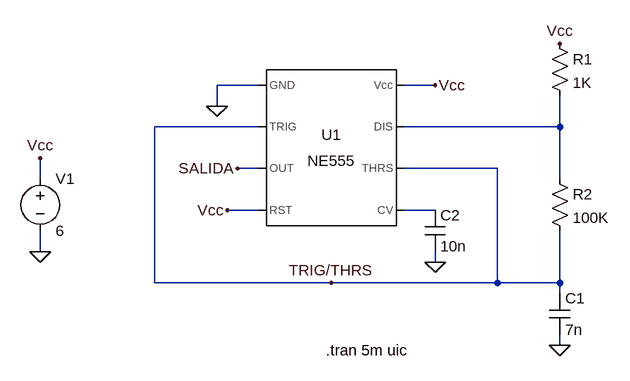
[diagram p0: schematic ne555-astable.asc]
ne555-astable.asc, the LTspice schematic file:
Version 4
SHEET 1 880 680
WIRE 80 80 16 80
WIRE 352 80 304 80
WIRE 16 112 16 80
WIRE 80 144 -80 144
WIRE 544 144 544 96
WIRE 544 144 304 144
WIRE 80 208 48 208
WIRE 448 208 304 208
WIRE -256 224 -256 192
WIRE 544 224 544 144
WIRE 80 272 32 272
WIRE 352 272 304 272
WIRE -256 336 -256 304
WIRE 352 352 352 336
WIRE -80 384 -80 144
WIRE 192 384 -80 384
WIRE 448 384 448 208
WIRE 448 384 192 384
WIRE 544 384 544 304
WIRE 544 384 448 384
WIRE 544 400 544 384
WIRE 544 480 544 464
FLAG -256 336 0
FLAG 352 352 0
FLAG -256 192 Vcc
FLAG 352 80 Vcc
FLAG 32 272 Vcc
FLAG 48 208 SALIDA
FLAG 16 112 0
FLAG 544 16 Vcc
FLAG 544 480 0
FLAG 192 384 TRIG/THRS
SYMBOL Misc\\NE555 192 176 R0
SYMATTR InstName U1
SYMBOL voltage -256 208 R0
WINDOW 123 0 0 Left 0
WINDOW 39 0 0 Left 0
SYMATTR InstName V1
SYMATTR Value 6
SYMBOL res 528 0 R0
SYMATTR InstName R1
SYMATTR Value 1K
SYMBOL res 528 208 R0
SYMATTR InstName R2
SYMATTR Value 100K
SYMBOL cap 336 272 R0
SYMATTR InstName C2
SYMATTR Value 10n
SYMBOL cap 528 400 R0
SYMATTR InstName C1
SYMATTR Value 7n
TEXT 184 488 Left 2 !.tran 5m uic

The netlist it stands for:
* ne555-astable.asc
XU1 0 TRIG/THRS SALIDA Vcc N002 TRIG/THRS N001 Vcc NE555  ; pins GND TRIG OUT RST CV THRS DIS Vcc
V1 Vcc 0 6
R1 Vcc N001 1K
R2 N001 TRIG/THRS 100K
C2 N002 0 10n
C1 TRIG/THRS 0 7n
.tran 5m uic
.lib NE555.sub
.backanno
.end